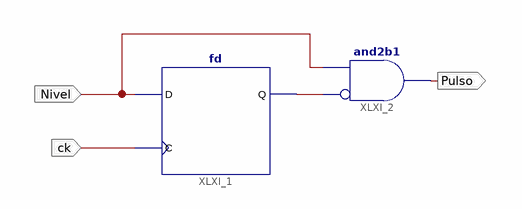
[diagram p0: schematic sheet 1]
// Xilinx ISE schematic Nivel_a_Pulso.sch (spartan6) as structural Verilog: 2 symbols, 3 ports
module Nivel_a_Pulso (
  input  Nivel,
  input  ck,
  output Pulso
);

  wire XLXN_3;

  fd XLXI_1 (.C(ck), .D(Nivel), .Q(XLXN_3));
  and XLXI_2 (Pulso, ~XLXN_3, Nivel);  // and2b1
endmodule
